# Altium schematic sheet 12-multimodal-accelerometer.SchDoc
size A; SheetNumber: 9; SheetTotal: 11
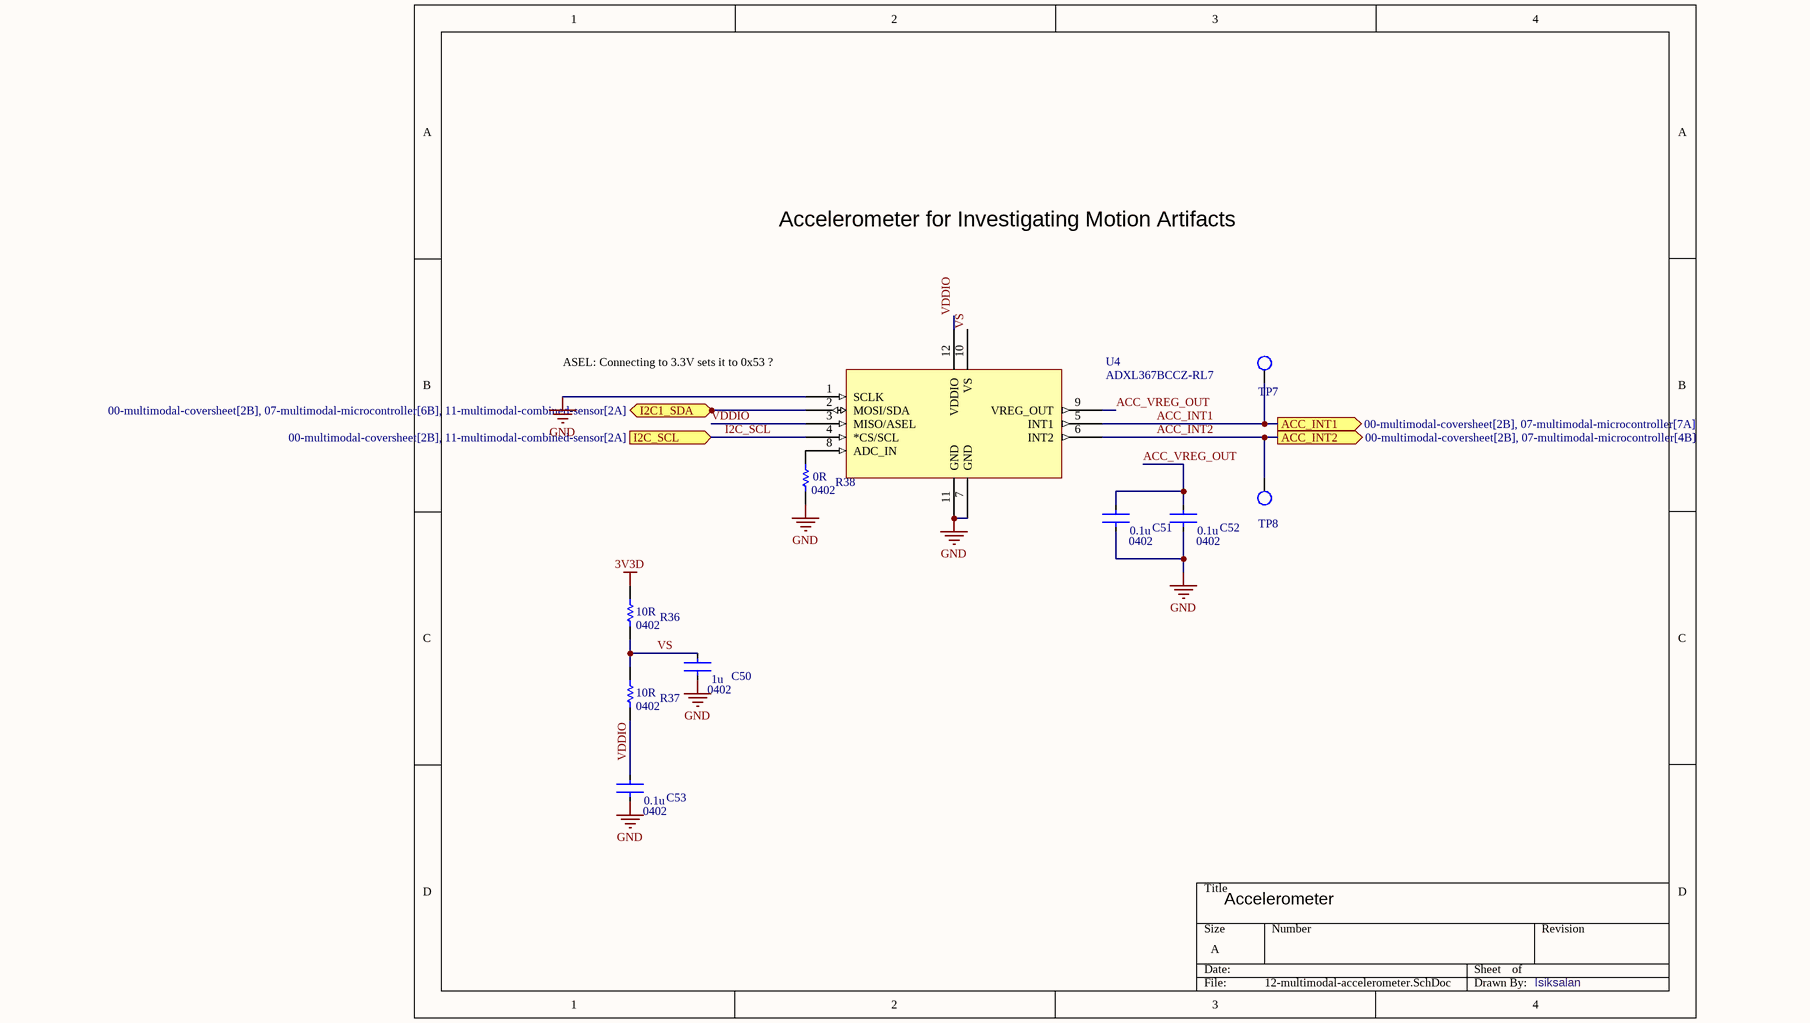
[diagram p0: 12-multimodal-accelerometer.SchDoc]

## Parts
C50  C1005X5R1V105K050BC  [CAPTDK0402]  (value not drawn)
C51  C1005X7R1H104K050BB  [CAPTDK0402]  (value not drawn)
C52  C1005X7R1H104K050BB  [CAPTDK0402]  (value not drawn)
C53  C1005X7R1H104K050BB  [CAPTDK0402]  (value not drawn)
R36  RMCF0402FT10R0  [RES-STACK-POLE-0402]  (value not drawn)
R37  RMCF0402FT10R0  [RES-STACK-POLE-0402]  (value not drawn)
R38  RMCF0402ZT0R00  [RES-STACK-POLE-0402]  (value not drawn)
TP7  TESTPOINT_S  [TESTPOINT_S]  (value not drawn)  (no BOM)
TP8  TESTPOINT_S  [TESTPOINT_S]  (value not drawn)  (no BOM)
U4  ADXL367BCCZ-RL7  [ADXL367BCCZ-RL7]

## Ports
ACC_INT1 (out, see 00-multimodal-coversheet[2B], 07-multimodal-microcontroller[7A]), ACC_INT2 (out, see 00-multimodal-coversheet[2B], 07-multimodal-microcontroller[4B]), I2C1_SDA (bidir, see 00-multimodal-coversheet[2B], 07-multimodal-microcontroller[6B], 11-multimodal-combined-sensor[2A]), I2C_SCL (in, see 00-multimodal-coversheet[2B], 11-multimodal-combined-sensor[2A])

## Nets
3V3D: R36.2
GND: C50.2 C51.2 C52.2 C53.2 R38.1 U4.1(SCLK) U4.7(GND) U4.11(GND)
ACC_INT1: TP7.1 U4.5(INT1) ; port ACC_INT1
ACC_INT2: TP8.1 U4.6(INT2) ; port ACC_INT2
ACC_VREG_OUT: C51.1 C52.1 U4.9(VREG_OUT)
I2C1_SDA: U4.2(MOSI/SDA) ; port I2C1_SDA
I2C_SCL: U4.4(*CS/SCL) ; port I2C_SCL
VDDIO: C53.1 R37.1 U4.3(MISO/ASEL) U4.12(VDDIO)
VS: C50.1 R36.1 R37.2 U4.10(VS)
NetR38_2: R38.2 U4.8(ADC_IN)

## Notes on the sheet
- Accelerometer for Investigating Motion Artifacts
- (near U4) ASEL: Connecting to 3.3V sets it to 0x53 ?
- Accelerometer
- Isiksalan
- (in symbol C1005X5R1V105K050BC) 1u; 0402
- (in symbol C1005X7R1H104K050BB) 0.1u; 0402
- (in symbol RMCF0402FT10R0) 10R; 0402
- (in symbol RMCF0402ZT0R00) 0R; 0402

## Library data of the parts
C50 = C1005X5R1V105K050BC: CAP CER 1UF 35V X5R 0402; Supplier 1: Digi-Key; Supplier Part Number 1: 445-9073-1-ND
C51-C53 = C1005X7R1H104K050BB: CAP CER 0.1UF 50V X7R 0402; Supplier 1: Digi-Key; Supplier Part Number 1: 445-5932-1-ND
R36 R37 = RMCF0402FT10R0: RES 10 OHM 1% 1/16W 0402; Supplier 1: Digi-Key; Supplier Part Number 1: RMCF0402FT10R0CT-ND
R38 = RMCF0402ZT0R00: RES 0 OHM JUMPER 1/16W 0402; Supplier 1: Digi-Key; Supplier Part Number 1: RMCF0402ZT0R00CT-ND
TP7 TP8 = TESTPOINT_S: Testpoint Surface Pad
U4 = ADXL367BCCZ-RL7: Accelerometer X, Y, Z Axis ±2g, 4g, 8g 6.25Hz ~ 200Hz 12-LGA (2.2x2.3); Manufacturer_Name: Analog Devices Inc; Type: Motion Sensors; Copyright: Copyright (C) 2025 Ultra Librarian. All rights reserved.; Manufacturer_Part_Number: ADXL367BCCZ-RL7; RefDes: RefDes; Supplier 1: DigiKey; Supplier Part Number 1: 505-ADXL367BCCZ-RL7CT-ND